# Altium schematic sheet S3220B3.SchDoc: Modem BG95
size A3; Revision: B; SheetNumber: 3; SheetTotal: 5
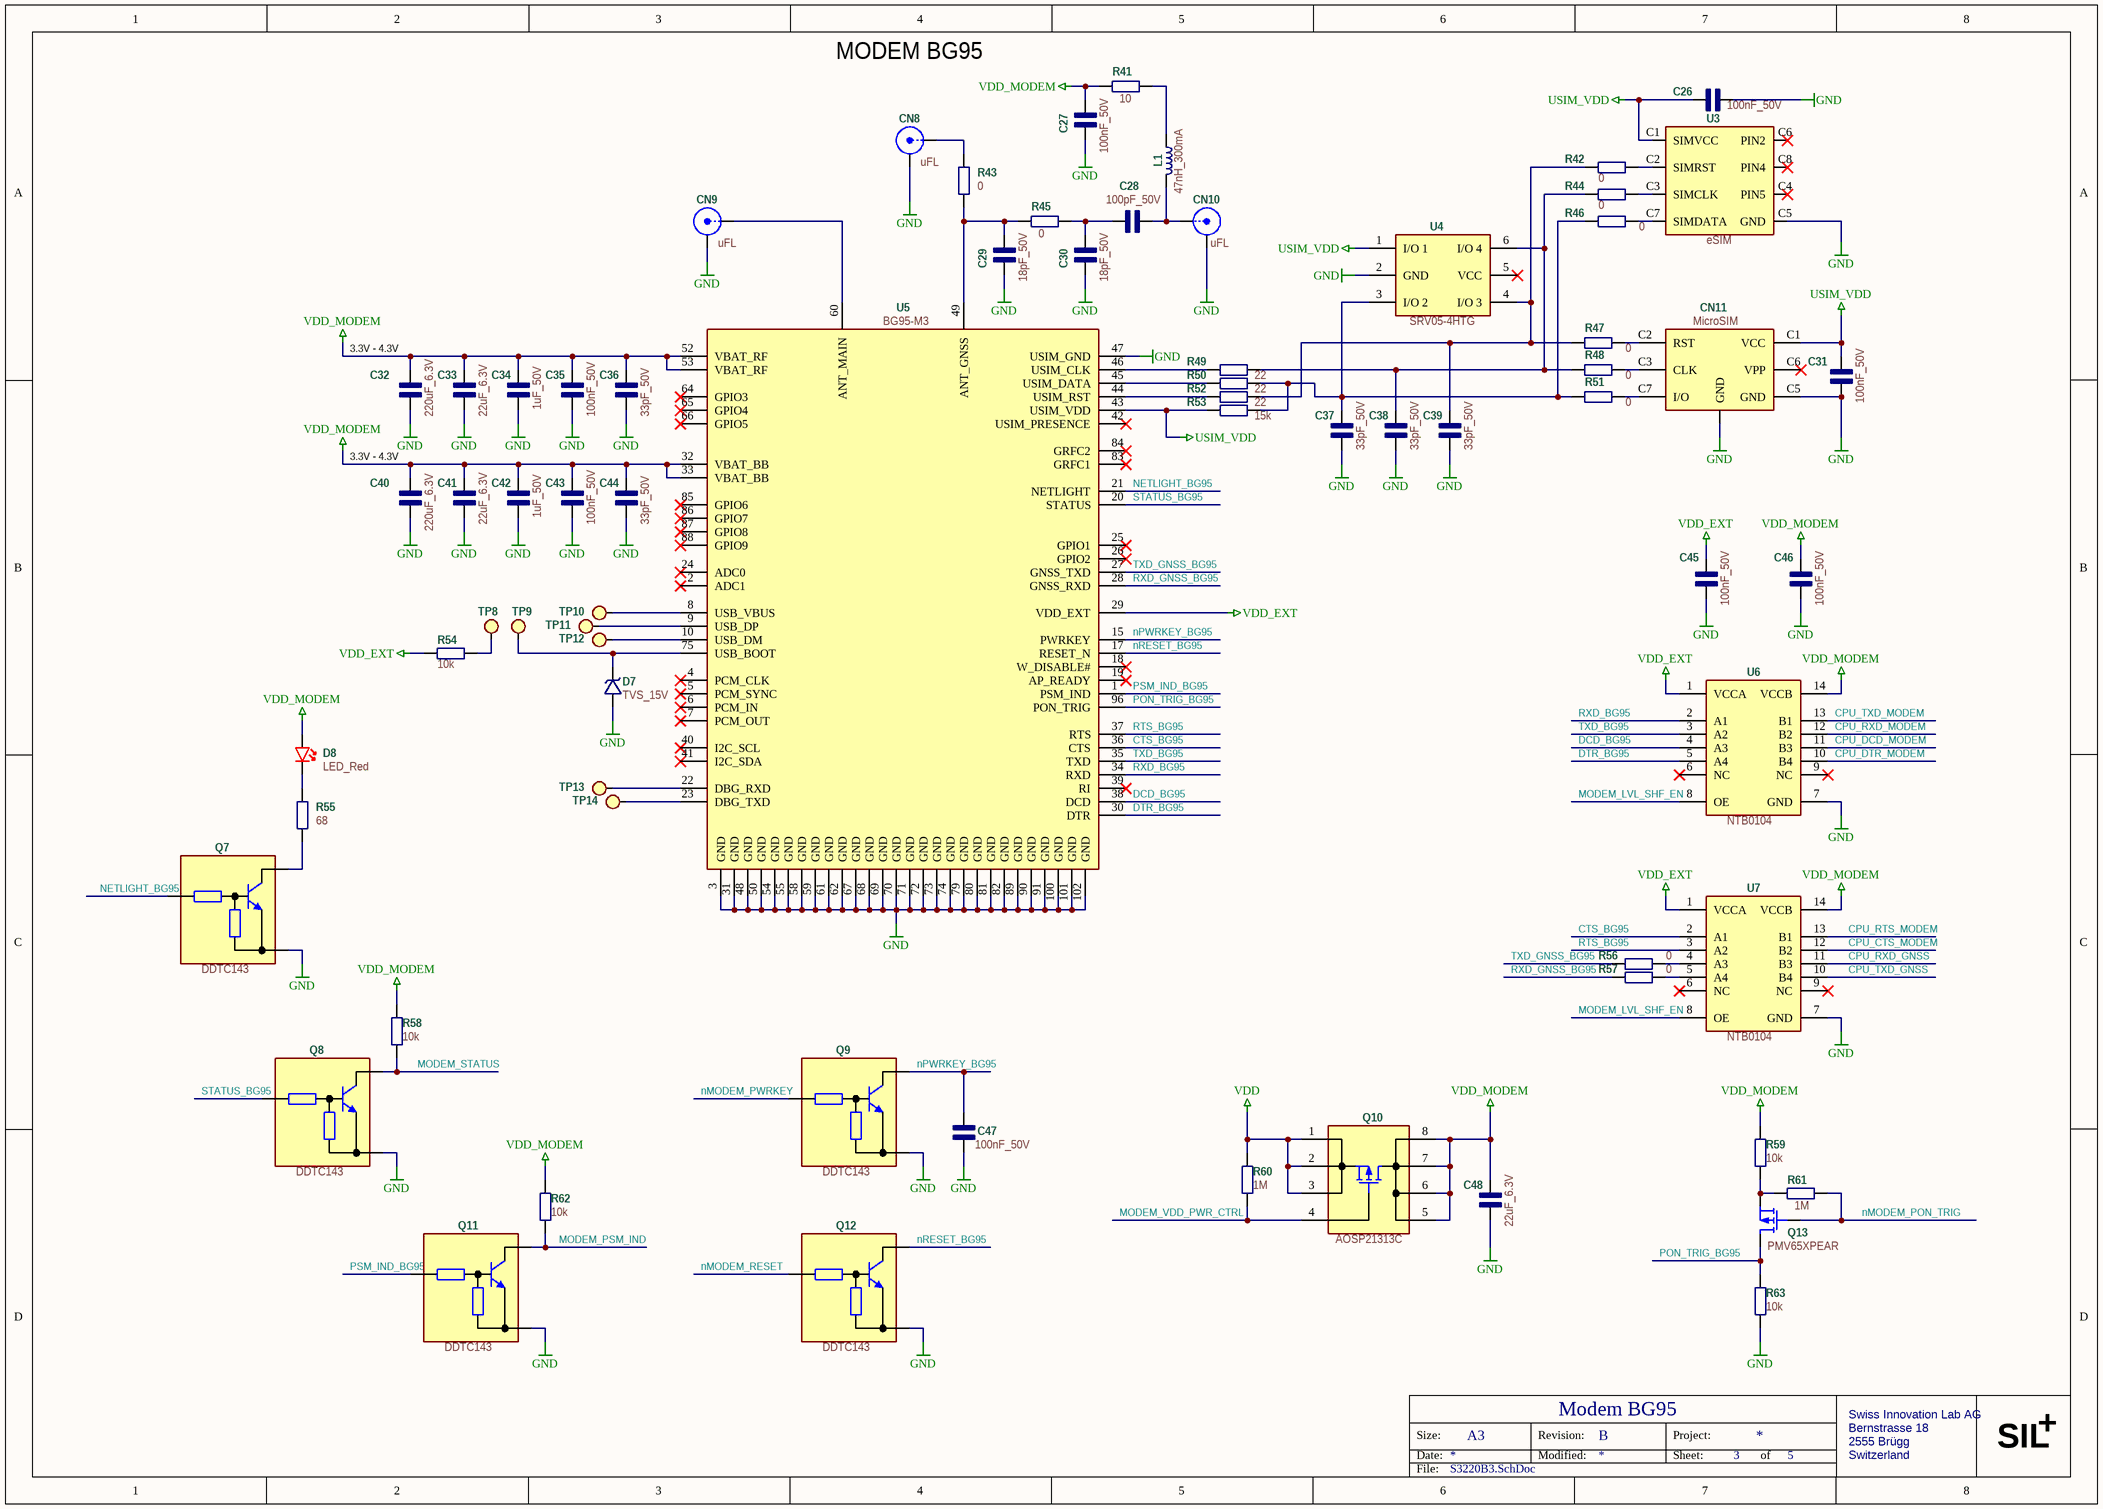
[diagram p0: S3220B3.SchDoc]

## Parts
C26  100nF_50V  [C_0603]
C27  100nF_50V  [C_0603]
C28  100pF_50V  [C_0603]
C29  18pF_50V  [C_0603]
C30  18pF_50V  [C_0603]
C31  100nF_50V  [C_0603]
C32  220uF_6.3V  [C_1206]
C33  22uF_6.3V  [C_0603]
C34  1uF_50V  [C_0603]
C35  100nF_50V  [C_0603]
C36  33pF_50V  [C_0603]
C37  33pF_50V  [C_0603]
C38  33pF_50V  [C_0603]
C39  33pF_50V  [C_0603]
C40  220uF_6.3V  [C_1206]
C41  22uF_6.3V  [C_0603]
C42  1uF_50V  [C_0603]
C43  100nF_50V  [C_0603]
C44  33pF_50V  [C_0603]
C45  100nF_50V  [C_0603]
C46  100nF_50V  [C_0603]
C47  100nF_50V  [C_0603]
C48  22uF_6.3V  [C_0603]
CN8  uFL  [CN_RF_uFL]
CN9  uFL  [CN_RF_uFL]
CN10  uFL  [CN_RF_uFL]
CN11  MicroSIM  [CN_MicroSIM-Holder]
D7  TVS_15V  [D_0603]
D8  LED_Red  [LED_0603]
L1  47nH_300mA  [L_0603]
Q7  DDTC143  [Q_SOT23]
Q8  DDTC143  [Q_SOT23]
Q9  DDTC143  [Q_SOT23]
Q10  AOSP21313C  [U_8-SOIC_3.9]
Q11  DDTC143  [Q_SOT23]
Q12  DDTC143  [Q_SOT23]
Q13  PMV65XPEAR  [U_SOT23-3]
R41  10  [R_0603]
R42  0  [R_0603]
R43  0  [R_0603]
R44  0  [R_0603]
R45  0  [R_0603]
R46  0  [R_0603]
R47  0  [R_0603]
R48  0  [R_0603]
R49  22  [R_0603]
R50  22  [R_0603]
R51  0  [R_0603]
R52  22  [R_0603]
R53  15k  [R_0603]
R54  10k  [R_0603]
R55  68  [R_0603]
R56  0  [R_0603]
R57  0  [R_0603]
R58  10k  [R_0603]
R59  10k  [R_0603]
R60  1M  [R_0603]
R61  1M  [R_0603]
R62  10k  [R_0603]
R63  10k  [R_0603]
TP8  Test point  [TP_SMD_R1.0mm]  (value not drawn)  (no BOM)
TP9  Test point  [TP_SMD_R1.0mm]  (value not drawn)  (no BOM)
TP10  Test point  [TP_SMD_R1.0mm]  (value not drawn)  (no BOM)
TP11  Test point  [TP_SMD_R1.0mm]  (value not drawn)  (no BOM)
TP12  Test point  [TP_SMD_R1.0mm]  (value not drawn)  (no BOM)
TP13  Test point  [TP_SMD_R1.0mm]  (value not drawn)  (no BOM)
TP14  Test point  [TP_SMD_R1.0mm]  (value not drawn)  (no BOM)
U3  eSIM  [U_MFF2]
U4  SRV05-4HTG  [U_SOT23-6]
U5  BG95-M3  [U_BG96_BG95]
U6  NTB0104  [U_14-DHVQFN]
U7  NTB0104  [U_14-DHVQFN]

## Nets
GND: C26.1 C27.1 C29.1 C30.1 C31.1 C32.1 C33.1 C34.2 C35.1 C36.1 C37.1 C38.1 C39.1 C40.1 C41.1 C42.2 C43.1 C44.1 C45.2 C46.2 C47.1 C48.1 CN8.G CN9.G CN10.G CN11.0(GND) CN11.C5(GND) D7.1 Q7.2(E) Q8.2(E) Q9.2(E) Q11.2(E) Q12.2(E) R63.2 U3.C5(GND) U4.2(GND) U5.3(GND) U5.31(GND) U5.47(USIM_GND) U5.48(GND) U5.50(GND) U5.54(GND) U5.55(GND) U5.58(GND) U5.59(GND) U5.61(GND) U5.62(GND) U5.67(GND) U5.68(GND) U5.69(GND) U5.70(GND) U5.71(GND) U5.72(GND) U5.73(GND) U5.74(GND) U5.79(GND) U5.80(GND) U5.81(GND) U5.82(GND) U5.89(GND) U5.90(GND) U5.91(GND) U5.100(GND) U5.101(GND) U5.102(GND) U6.7(GND) U7.7(GND)
USIM_VDD: C26.2 C31.2 CN11.C1(VCC) R53.1 U3.C1(SIMVCC) U4.1(I/O_1) U5.43(USIM_VDD)
VDD: Q10.1(S) Q10.2(S) Q10.3(S) R60.2
VDD_EXT: C45.1 R54.1 U5.29(VDD_EXT) U6.1(VCCA) U7.1(VCCA)
VDD_MODEM: C27.2 C32.2 C33.2 C34.1 C35.2 C36.2 C40.2 C41.2 C42.1 C43.2 C44.2 C46.1 C48.2 D8.1(A) Q10.5(D) Q10.6(D) Q10.7(D) Q10.8(D) R41.1 R58.1 R59.1 R62.1 U5.32(VBAT_BB) U5.33(VBAT_BB) U5.52(VBAT_RF) U5.53(VBAT_RF) U6.14(VCCB) U7.14(VCCB)
CPU_CTS_MODEM: U7.12(B2)
CPU_DCD_MODEM: U6.11(B3)
CPU_DTR_MODEM: U6.10(B4)
CPU_RTS_MODEM: U7.13(B1)
CPU_RXD_GNSS: U7.11(B3)
CPU_RXD_MODEM: U6.12(B2)
CPU_TXD_GNSS: U7.10(B4)
CPU_TXD_MODEM: U6.13(B1)
CTS_BG95: U5.36(CTS) U7.2(A1)
DCD_BG95: U5.38(DCD) U6.4(A3)
DTR_BG95: U5.30(DTR) U6.5(A4)
MODEM_LVL_SHF_EN: U6.8(OE) U7.8(OE)
MODEM_PSM_IND: Q11.3(C) R62.2
MODEM_STATUS: Q8.3(C) R58.2
MODEM_VDD_PWR_CTRL: Q10.4(G) R60.1
NETLIGHT_BG95: Q7.1(B) U5.21(NETLIGHT)
nMODEM_PON_TRIG: Q13.1(G) R61.1
nMODEM_PWRKEY: Q9.1(B)
nMODEM_RESET: Q12.1(B)
nPWRKEY_BG95: C47.2 Q9.3(C) U5.15(PWRKEY)
nRESET_BG95: Q12.3(C) U5.17(RESET_N)
PON_TRIG_BG95: Q13.3(D) R63.1 U5.96(PON_TRIG)
PSM_IND_BG95: Q11.1(B) U5.1(PSM_IND)
RTS_BG95: U5.37(RTS) U7.3(A2)
RXD_BG95: U5.34(RXD) U6.2(A1)
RXD_GNSS_BG95: R57.1 U5.28(GNSS_RXD)
STATUS_BG95: Q8.1(B) U5.20(STATUS)
TXD_BG95: U5.35(TXD) U6.3(A2)
TXD_GNSS_BG95: R56.1 U5.27(GNSS_TXD)
NetC28_1: C28.1 C30.2 R45.2
NetC28_2: C28.2 CN10.S L1.2
NetC29_2: C29.2 R43.1 R45.1 U5.49(ANT_GNSS)
NetC37_2: C37.2 R46.2 R50.2 R51.1 R53.2 U4.3(I/O_2)
NetC38_2: C38.2 R44.2 R48.1 R49.2 U4.6(I/O_4)
NetC39_2: C39.2 R42.2 R47.1 R52.2 U4.4(I/O_3)
NetCN8_S: CN8.S R43.2
NetCN9_S: CN9.S U5.60(ANT_MAIN)
NetCN11_C2: CN11.C2(RST) R47.2
NetCN11_C3: CN11.C3(CLK) R48.2
NetCN11_C7: CN11.C7(I/O) R51.2
NetD7_2: D7.2 TP9.1 U5.75(USB_BOOT)
NetD8_2: D8.2(K) R55.2
NetL1_1: L1.1 R41.2
NetQ7_3: Q7.3(C) R55.1
NetQ13_2: Q13.2(S) R59.2 R61.2
NetR42_1: R42.1 U3.C2(SIMRST)
NetR44_1: R44.1 U3.C3(SIMCLK)
NetR46_1: R46.1 U3.C7(SIMDATA)
NetR49_1: R49.1 U5.46(USIM_CLK)
NetR50_1: R50.1 U5.45(USIM_DATA)
NetR52_1: R52.1 U5.44(USIM_RST)
NetR54_2: R54.2 TP8.1
NetR56_2: R56.2 U7.4(A3)
NetR57_2: R57.2 U7.5(A4)
NetTP10_1: TP10.1 U5.8(USB_VBUS)
NetTP11_1: TP11.1 U5.9(USB_DP)
NetTP12_1: TP12.1 U5.10(USB_DM)
NetTP13_1: TP13.1 U5.22(DBG_RXD)
NetTP14_1: TP14.1 U5.23(DBG_TXD)

Not connected (* = marked no-connect by the designer): CN11 C6(VPP)* X1 X2; U3 C4(PIN5)* C6(PIN2)* C8(PIN4)* NC; U4 5(VCC)*; U5 2(ADC1)* 4(PCM_CLK)* 5(PCM_SYNC)* 6(PCM_IN)* 7(PCM_OUT)* 11(RESERVED) 12(RESERVED) 13(RESERVED) 14(RESERVED) 16(RESERVED) 18(W_DISABLE#)* 19(AP_READY)* 24(ADC0)* 25(GPIO1)* 26(GPIO2)* 39(RI)* 40(I2C_SCL)* 41(I2C_SDA)* 42(USIM_PRESENCE)* 51(RESERVED) 56(RESERVED) 57(RESERVED) 63(RESERVED) 64(GPIO3)* 65(GPIO4)* 66(GPIO5)* 76(RESERVED) 77(RESERVED) 78(RESERVED) 83(GRFC1)* 84(GRFC2)* 85(GPIO6)* 86(GPIO7)* 87(GPIO8)* 88(GPIO9)* 92(RESERVED) 93(RESERVED) 94(RESERVED) 95(RESERVED) 97(RESERVED) 98(RESERVED) 99(RESERVED); U6 6(NC)* 9(NC)*; U7 6(NC)* 9(NC)*

## Notes on the sheet
- MODEM BG95
- (near C32) 3.3V - 4.3V
- (near C40) 3.3V - 4.3V
- Size:
- Date:
- A3
- Revision:
- Modified:
- Project:
- Sheet:
- of
- Swiss Innovation Lab AG
- Bernstrasse 18
- 2555 Brügg
- Switzerland
- SIL
- +
- File:

## Library data of the parts
C26 C27 C31 C35 C43 C45-C47 = C_100nF_50V: 0.1µF ±10% 50V Ceramic Capacitor X7R 0603 (1608 Metric); Manufacturer: TDK; Manufacturer Part Number: C1608X7R1H104K080AA; Value: 100nF; ValueAux: _50V; Currency: $; Price: 0,01309; Supplier 1: Digi-Key; Supplier Part Number 1: 445-1314-6-ND
C28 = C_33pF_50V: 33pF ±1% 50V Ceramic Capacitor C0G, NP0 0603 (1608 Metric); Manufacturer: Samsung Electro-Mechanics; Manufacturer Part Number: CL10C101FB8NNNC; Value: 100pF; ValueAux: _50V; Currency: $; Price: 0,04166; Supplier 1: Digi-Key; Supplier Part Number 1: 1276-2159-2-ND
C29 C30 = C_18pF_50V: 18pF ±5% 50V Ceramic Capacitor C0G, NP0 0603 (1608 Metric); Manufacturer: KEMET; Manufacturer Part Number: C0603C180J5GACTU; ValueAux: _50V; Currency: $; Value: 18pF; Price: 0,00974; Supplier 1: Digi-Key; Supplier Part Number 1: 399-1052-1-ND
C32 C40 = C_220uF_6.3V: 220µF ±20% 6.3V Ceramic Capacitor X5R 1206 (3216 Metric); Manufacturer: Murata Electronics North America; Manufacturer Part Number: GRM31CR60J227ME11L; Value: 220uF; ValueAux: _6.3V; Currency: $; Price: 0,59945; Supplier 1: Digi-Key; Supplier Part Number 1: 490-13970-1-ND
C33 C41 C48 = C_22uF_6V3: 22µF ±20% 6.3V Ceramic Capacitor X5R 0603 (1608 Metric); Manufacturer: Samsung Electro-Mechanics; Manufacturer Part Number: CL10A226MQ8NRNC; Value: 22uF; ValueAux: _6.3V; Currency: $; Price: 0,04566; Supplier 1: Digi-Key; Supplier Part Number 1: 1276-1193-1-ND
C34 C42 = C_1uF_50V: 1µF 50V Ceramic Capacitor X5R 0603 (1608 Metric) 0.063" L x 0.032" W (1.60mm x 0.80mm); Manufacturer: Samsung Electro-Mechanics; Manufacturer Part Number: CL10A105KB8NNNC; Value: 1uF; ValueAux: _50V; Currency: $; Price: 0,03472; Supplier 1: Digi-Key; Supplier Part Number 1: 1276-1860-1-ND
C36-C39 C44 = C_33pF_50V: 33pF ±1% 50V Ceramic Capacitor C0G, NP0 0603 (1608 Metric); Manufacturer: Samsung Electro-Mechanics; Manufacturer Part Number: CL10C330FB8NNNC; ValueAux: _50V; Currency: $; Value: 33pF; Price: 0,04166; Supplier 1: Digi-Key; Supplier Part Number 1: 1276-2262-6-ND
CN8-CN10 = CN_RF_uFL: Ultra Miniature Coaxial Connector Jack, Male Pin 50 Ohm Surface Mount Solder; Manufacturer: TE Connectivity AMP Connectors; Manufacturer Part Number: 1909763-1; Currency: $; Value: uFL; Price: 0,25410; Supplier 1: Digi-Key; Supplier Part Number 1: A118077CT-ND
CN11 = CN_MicroSIM-Holder: 6 Position Card Connector Micro SIM Surface Mount, Right Angle Gold; Manufacturer: Molex LLC; Manufacturer Part Number: 0788000001; Currency: $; Value: MicroSIM; Price: 1,14178; Supplier 1: Digi-Key; Supplier Part Number 1: WM9786CT-ND
D7 = D_TVS_15V: TVS DIODE 15V 27.4V DSN1608-2; Manufacturer: Nexperia USA Inc.; Manufacturer Part Number: PTVS15VZ1USKYL; ValueAux: _15V; Currency: $; Value: TVS; Price: 0,09950; Supplier 1: Digi-Key; Supplier Part Number 1: 1727-2745-6-ND
D8 = D_LED_R_5mA: Red 631nm LED Indication - Discrete 2V 0603; Manufacturer: Lite-On Inc.; Manufacturer Part Number: LTST-C193KRKT-5A; ValueAux: _Red; Currency: $; Value: LED; Price: 0,07565; Supplier 1: Digi-Key; Supplier Part Number 1: 160-1830-1-ND
L1 = L_47nH_300mA: 47nH Unshielded Multilayer Inductor 300mA 700 mOhm Max 0603 (1608 Metric); Manufacturer: Taiyo Yuden; Manufacturer Part Number: HK160847NJ-T; ValueAux: _300mA; Currency: $; Value: 47nH; Price: 0,03961; Supplier 1: Digi-Key; Supplier Part Number 1: 587-1553-1-ND
Q7-Q9 Q11 Q12 = Q_DDTC143: Pre-Biased Bipolar Transistor (BJT) NPN - Pre-Biased 50 V 100 mA 250 MHz 200 mW Surface Mount SOT-23-3; Manufacturer: Diodes Incorporated; Manufacturer Part Number: DDTC143ZCA-7-F; Currency: $; Value: DDTC143; Price: 0,04198; Supplier 1: Digi-Key; Supplier Part Number 1: DDTC143ZCA-FDICT-ND
Q10 = Q_AOSP21313C: P-Channel 30 V 7A (Ta) 2.5W (Ta) Surface Mount 8-SOIC; Manufacturer: Alpha & Omega Semi.; Currency: $; Value: AOSP21313C; Manufacturer Part Number: AOSP21313C; Price: 0,28336; Supplier 1: Digi-Key; Supplier Part Number 1: 785-AOSP21313CCT-ND
Q13 = Q_PMV65: P-Channel 20V 2.8A (Ta) 480mW (Ta), 6.25W (Tc) Surface Mount TO-236AB (SOT23); Manufacturer: Nexperia USA Inc.; Currency: $; Value: PMV65XPEAR; Manufacturer Part Number: PMV65XPEAR; Price: 0,11204; Supplier 1: Digi-Key; Supplier Part Number 1: 1727-2310-1-ND
R41 = R_10_1%: 10 Ohms ±1% 0.1W, 1/10W Chip Resistor 0603 (1608 Metric) Automotive AEC-Q200 Thick Film; Manufacturer: Panasonic Electronic Components; Manufacturer Part Number: ERJ-3EKF10R0V; Currency: $; Value: 10; Price: 0,01153; Supplier 1: Digi-Key; Supplier Part Number 1: P10.0HCT-ND
R42-R48 R51 R56 R57 = R_0_1%: 0 Ohms Jumper 0.1W, 1/10W Chip Resistor 0603 (1608 Metric) Automotive AEC-Q200 Thick Film; Manufacturer: Panasonic Electronic Components; Manufacturer Part Number: ERJ-3GEY0R00V; Currency: $; Value: 0; Price: 0,00962; Supplier 1: Digi-Key; Supplier Part Number 1: P0.0GCT-ND
R49 R50 R52 = R_22_1%: 22 Ohms ±1% 0.1W, 1/10W Chip Resistor 0603 (1608 Metric) Automotive AEC-Q200 Thick Film; Manufacturer: Panasonic Electronic Components; Manufacturer Part Number: ERJ-3EKF22R0V; Currency: $; Value: 22; Price: 0,01153; Supplier 1: Digi-Key; Supplier Part Number 1: P22.0HCT-ND
R53 = R_15k_1%: 15 kOhms ±1% 0.1W, 1/10W Chip Resistor 0603 (1608 Metric) Automotive AEC-Q200, Moisture Resistant Thick Film; Manufacturer: Yageo; Manufacturer Part Number: AC0603FR-0715KL; Currency: $; Value: 15k; Price: 0,00527; Supplier 1: Digi-Key; Supplier Part Number 1: YAG3569DKR-ND
R54 R58 R59 R62 R63 = R_10k_1%: 10 kOhms ±1% 0.1W, 1/10W Chip Resistor 0603 (1608 Metric) Automotive AEC-Q200 Thick Film; Manufacturer: Panasonic Electronic Components; Manufacturer Part Number: ERJ-3EKF1002V; Currency: $; Value: 10k; Price: 0,01449; Supplier 1: Digi-Key; Supplier Part Number 1: P10.0KHCT-ND
R55 = R_68_1%: 68 Ohms ±1% 0.1W, 1/10W Chip Resistor 0603 (1608 Metric) Automotive AEC-Q200 Thick Film; Manufacturer: Panasonic Electronic Components; Manufacturer Part Number: ERJ-3EKF68R0V; Currency: $; Value: 68; Price: 0,01449; Supplier 1: Digi-Key; Supplier Part Number 1: P68.0HCT-ND
R60 R61 = R_1M_1%: 1 MOhms ±1% 0.1W, 1/10W Chip Resistor 0603 (1608 Metric) Automotive AEC-Q200 Thick Film; Manufacturer: Panasonic Electronic Components; Manufacturer Part Number: ERJ-3EKF1004V; Currency: $; Value: 1M; Price: 0,01264; Supplier 1: Digi-Key; Supplier Part Number 1: P1.00MHCT-ND
TP8-TP14 = TP_Test_point: Manufacturer: Swiss Innovation Lab; Currency: $; Value: Test point; Manufacturer Part Number: Test point; Price: 0
U3 = U_eSIM-M2M: M2M embedded SIM card IC; Manufacturer: 1NCE; Currency: $; Value: eSIM; Manufacturer Part Number: eSIM; Price: 12,0; Supplier 1: 1NCE; Supplier Part Number 1: eSIM
U4 = U_SRV05-4HTG: TVS DIODE 6V 15V SOT23-6; Manufacturer: Littelfuse Inc.; Currency: $; Value: SRV05-4HTG; Manufacturer Part Number: SRV05-4HTG; Price: 0,40556; Supplier 1: Digi-Key; Supplier Part Number 1: F4204CT-ND
U5 = U_BG95: MultiBand, 3GPP Rel.13, LTE Cat.M1/NB1, GSM/EGPRS, 3xUART, VoLTE; Manufacturer: Quectel; Currency: $; Value: BG95-M3; Manufacturer Part Number: BG95-M3; Price: 15,98590; Supplier 1: Codico; Supplier Part Number 1: BG95-M3
U6 U7 = U_NTB0104BQ: Voltage Level Translator Bidirectional 1 Circuit 4 Channel 100Mbps 14-DHVQFN (2.5x3); Manufacturer: NXP USA Inc.; Manufacturer Part Number: NTB0104BQ,115; Currency: $; Value: NTB0104; Price: 0,57635; Supplier 1: Digi-Key; Supplier Part Number 1: 568-8404-1-ND